# EAGLE schematic ADC3_FPGA_BGA (EAGLE 9.6.2)
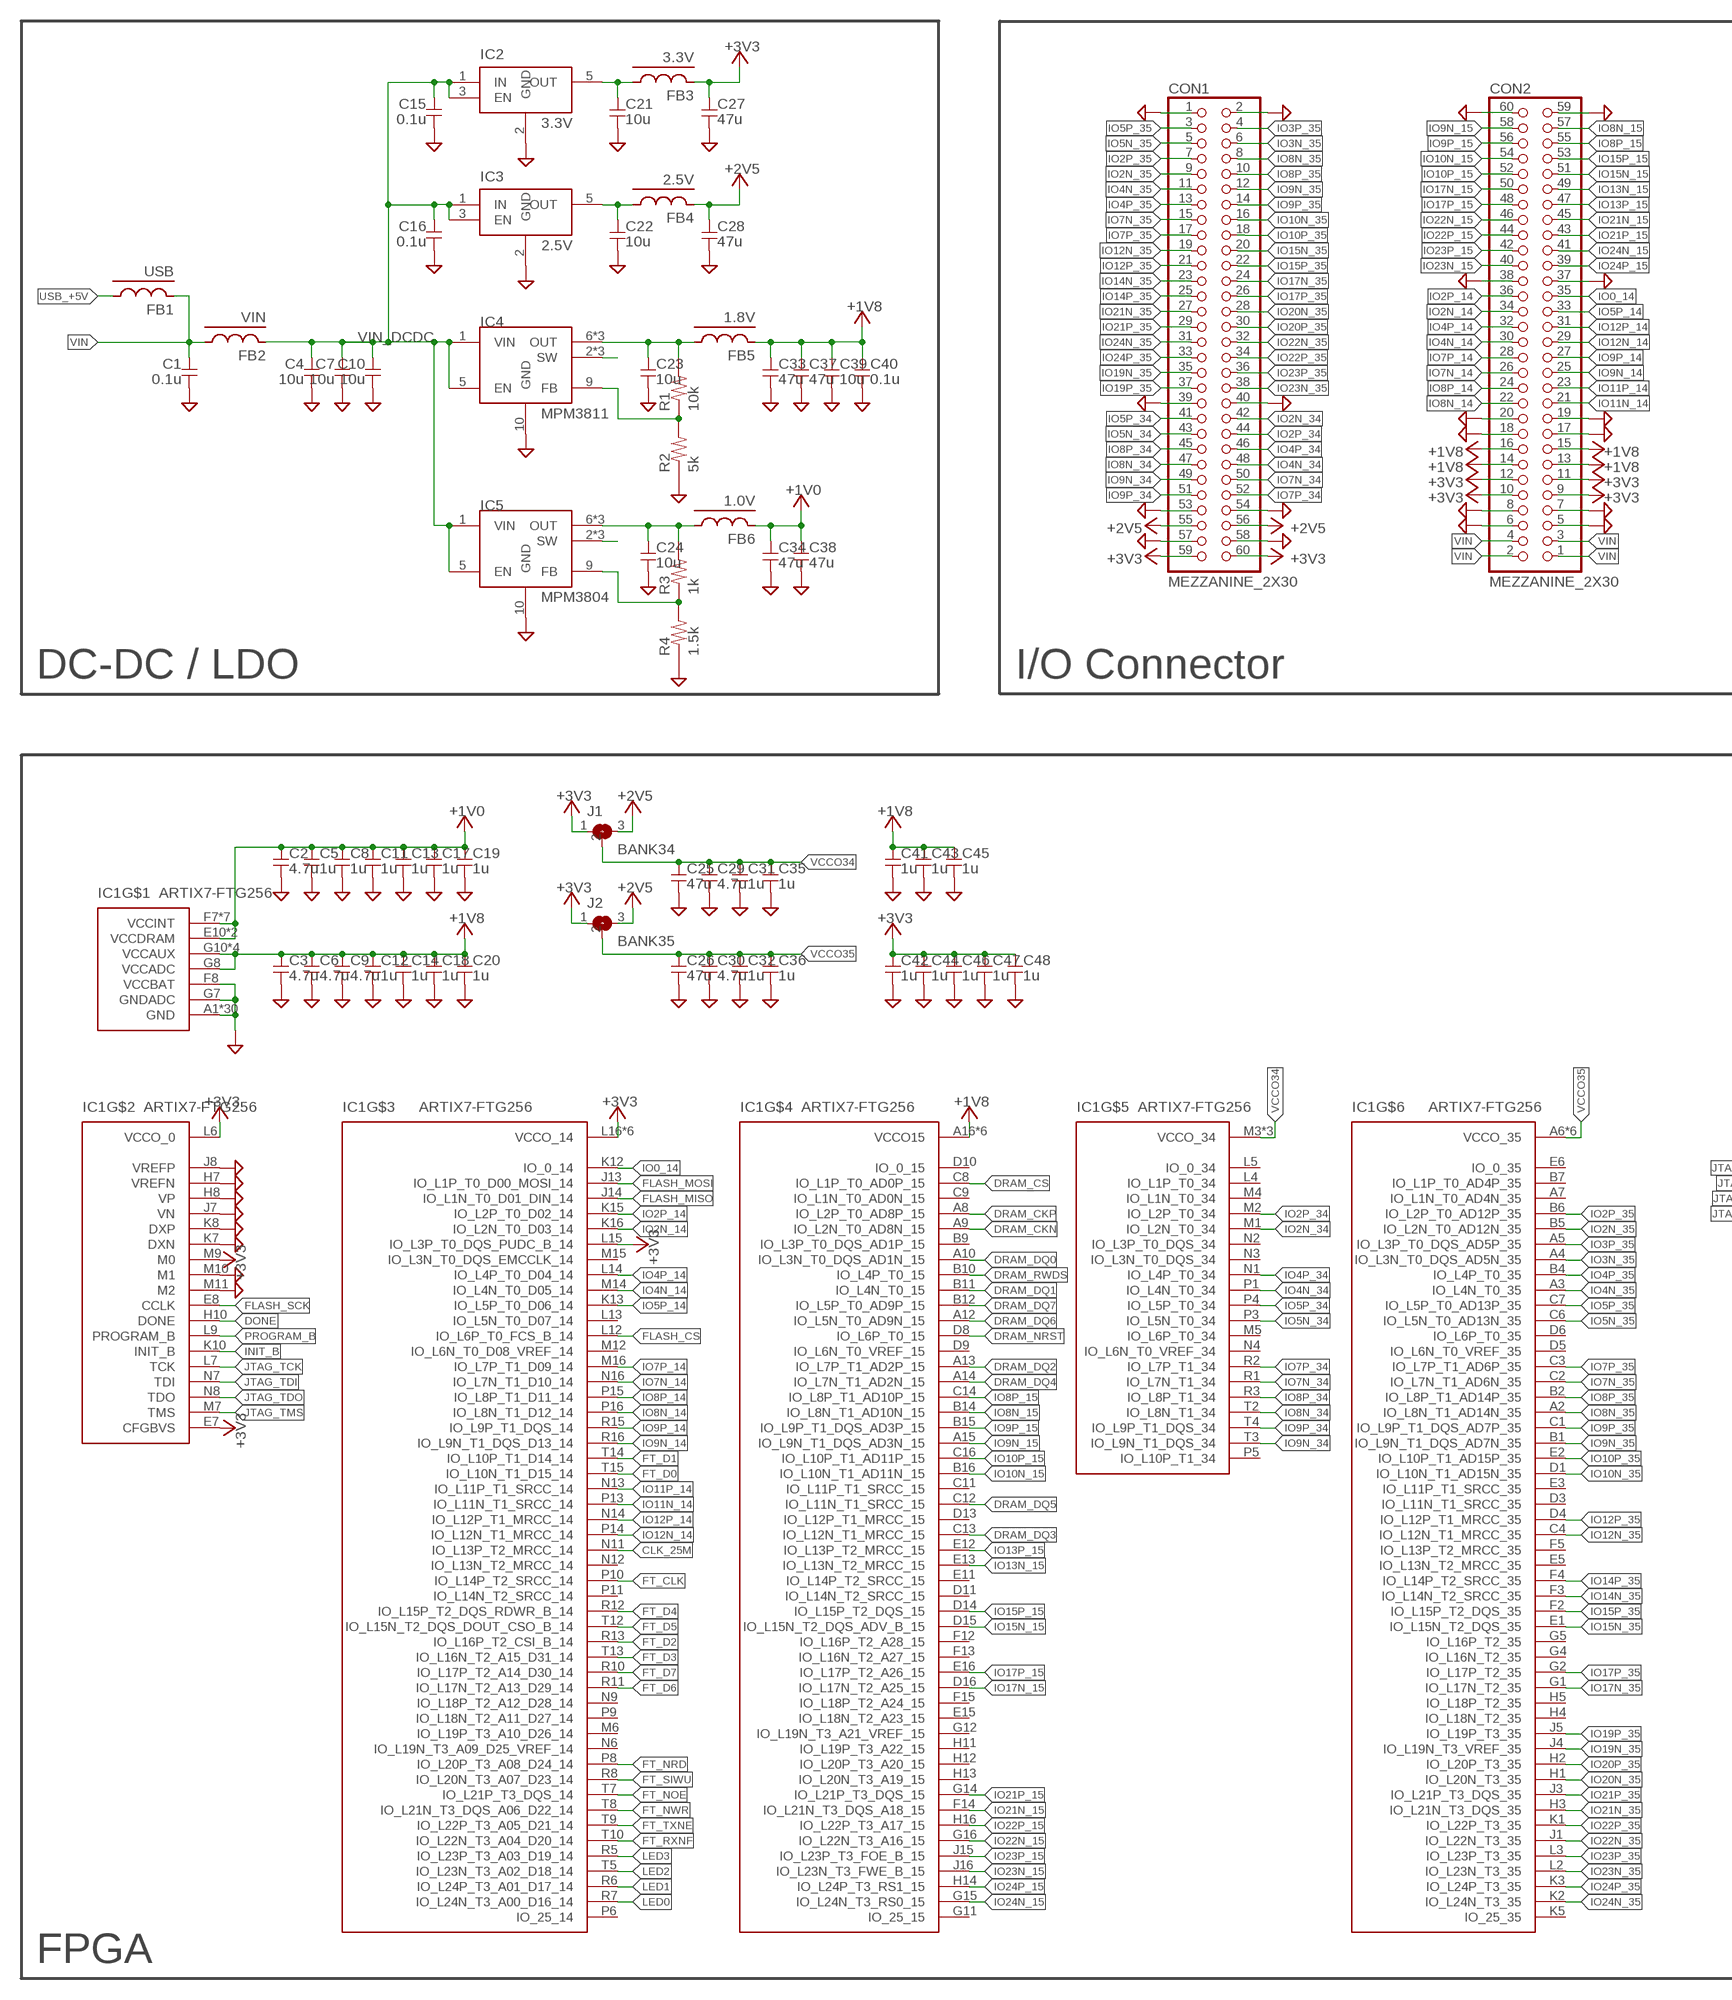
[diagram p0: schematic, sheet 1, part 1 of 2]
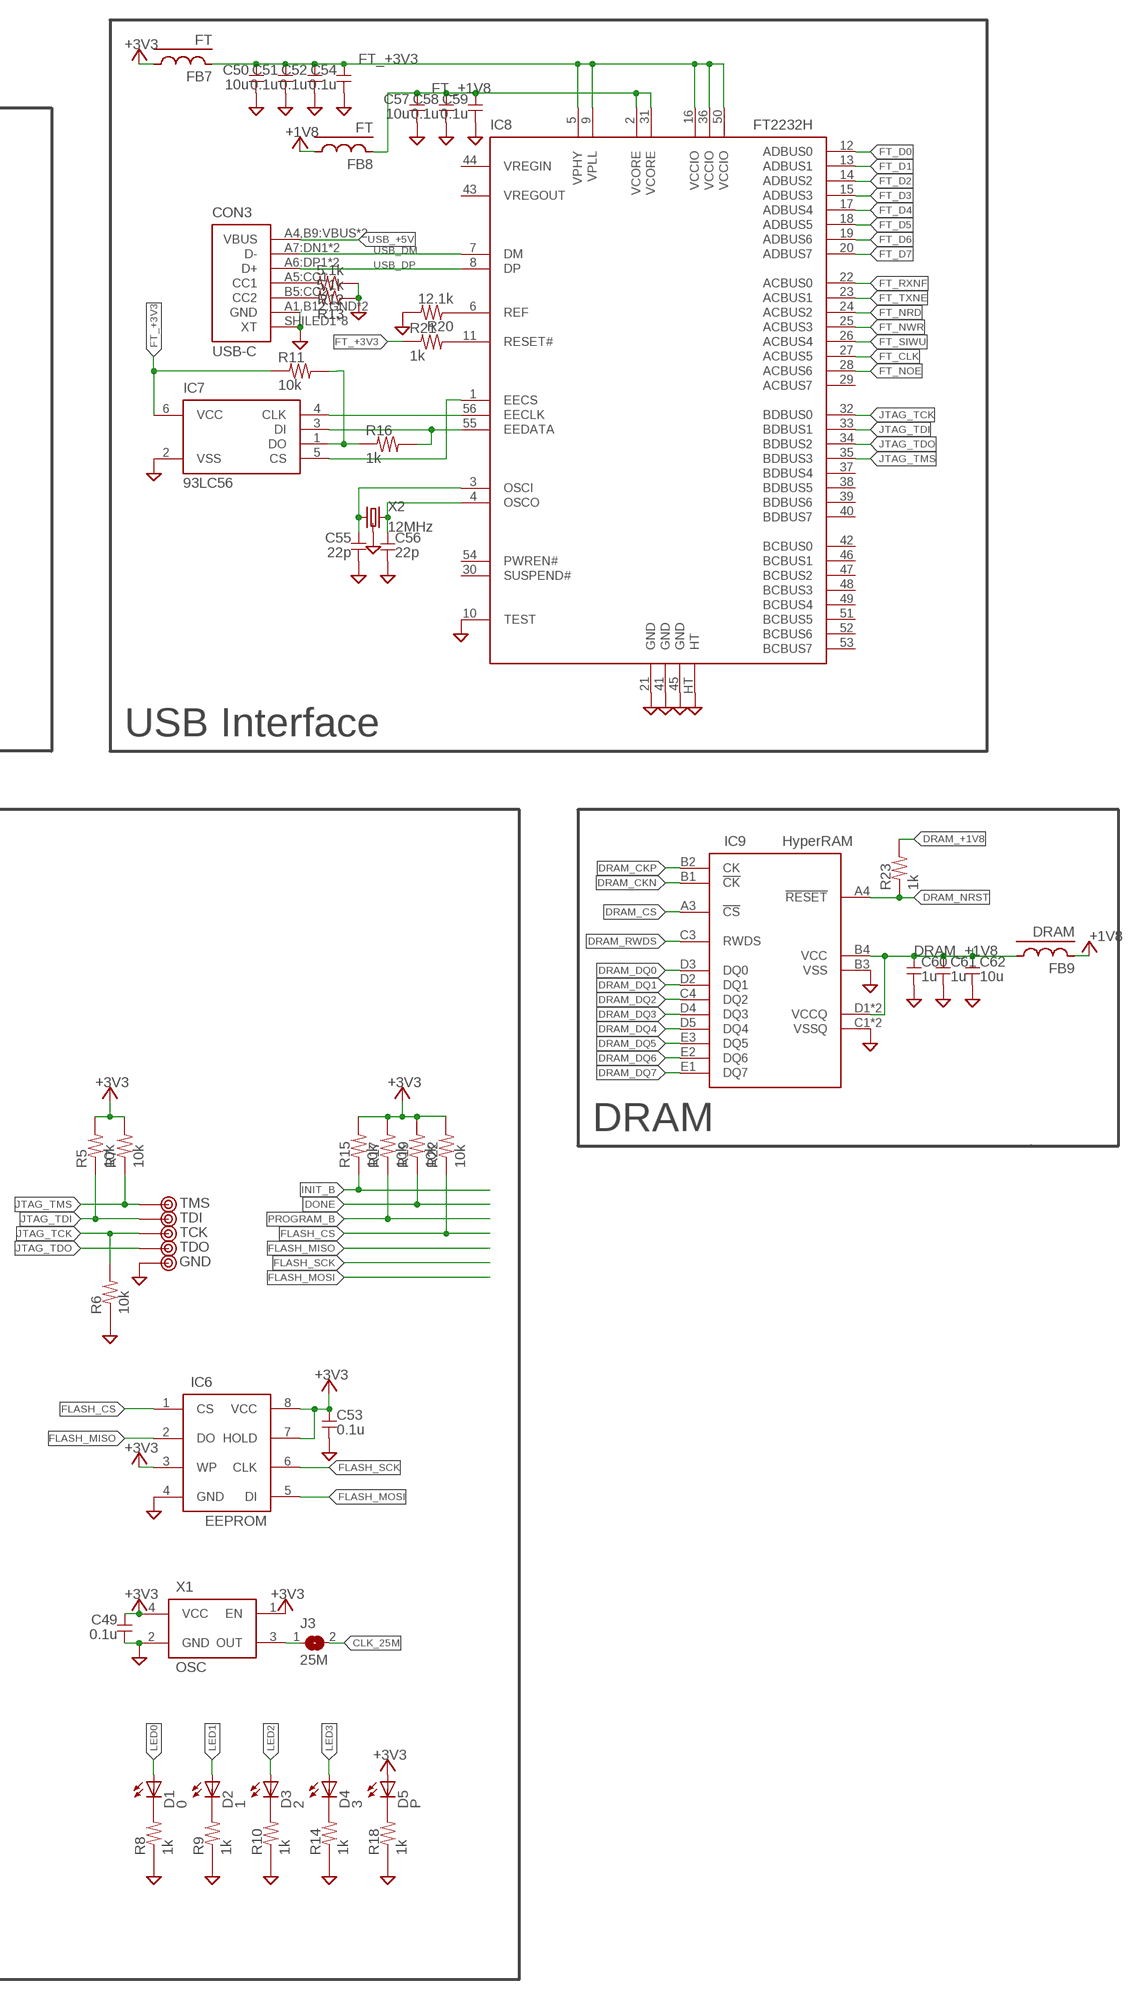
[diagram p1: schematic, sheet 1, part 2 of 2]

## Parts
C1  0.1u  C-1608  [1608C]
C2  4.7u  C-1608  [1608C]
C3  4.7u  C-1608  [1608C]
C4  10u  C-2012  [2012]
C5  1u  C-1005  [1005]
C6  4.7u  C-1608  [1608C]
C7  10u  C-1608  [1608C]
C8  1u  C-1005  [1005]
C9  4.7u  C-1608  [1608C]
C10  10u  C-1608  [1608C]
C11  1u  C-1005  [1005]
C12  1u  C-1005  [1005]
C13  1u  C-1005  [1005]
C14  1u  C-1005  [1005]
C15  0.1u  C-1608  [1608C]
C16  0.1u  C-1608  [1608C]
C17  1u  C-1005  [1005]
C18  1u  C-1005  [1005]
C19  1u  C-1005  [1005]
C20  1u  C-1005  [1005]
C21  10u  C-1608  [1608C]
C22  10u  C-1608  [1608C]
C23  10u  C-1608  [1608C]
C24  10u  C-1608  [1608C]
C25  47u  C-2012  [2012]
C26  47u  C-2012  [2012]
C27  47u  C-2012  [2012]
C28  47u  C-2012  [2012]
C29  4.7u  C-1608  [1608C]
C30  4.7u  C-1608  [1608C]
C31  1u  C-1005  [1005]
C32  1u  C-1005  [1005]
C33  47u  C-2012  [2012]
C34  47u  C-2012  [2012]
C35  1u  C-1005  [1005]
C36  1u  C-1005  [1005]
C37  47u  C-2012  [2012]
C38  47u  C-2012  [2012]
C39  10u  C-3216  [3216]
C40  0.1u  C-1608  [1608C]
C41  1u  C-1005  [1005]
C42  1u  C-1005  [1005]
C43  1u  C-1005  [1005]
C44  1u  C-1005  [1005]
C45  1u  C-1005  [1005]
C46  1u  C-1005  [1005]
C47  1u  C-1005  [1005]
C48  1u  C-1005  [1005]
C49  0.1u  C-1608  [1608C]
C50  10u  C-1608  [1608C]
C51  0.1u  C-1608  [1608C]
C52  0.1u  C-1608  [1608C]
C53  0.1u  C-1608  [1608C]
C54  0.1u  C-1608  [1608C]
C55  22p  C-1608  [1608C]
C56  22p  C-1608  [1608C]
C57  10u  C-1608  [1608C]
C58  0.1u  C-1608  [1608C]
C59  0.1u  C-1608  [1608C]
C60  1u  C-1608  [1608C]
C61  1u  C-1608  [1608C]
C62  10u  C-2012  [2012]
CON1  MEZZANINE_2X30  [MEZZANINE_0.8MM_2X30]
CON2  MEZZANINE_2X30  [MEZZANINE_0.8MM_2X30]
CON3  USB-C  [5077CR-16-SMC2-BK-TR]
D1  0  LED-SMD1608  [D1608]
D2  1  LED-SMD1608  [D1608]
D3  2  LED-SMD1608  [D1608]
D4  3  LED-SMD1608  [D1608]
D5  P  LED-SMD1608  [D1608]
FB1  USB  FB  [1608-J]
FB2  VIN  FB  [1608-J]
FB3  3.3V  FB  [1608-J]
FB4  2.5V  FB  [1608-J]
FB5  1.8V  FB  [1608-J]
FB6  1.0V  FB  [1608-J]
FB7  FT  FB  [1608-J]
FB8  FT  FB  [1608-J]
FB9  DRAM  FB  [1608-J]
IC1  ARTIX7-FTG256  [FTG256]
IC2  3.3V  TLV740  [SOT23-5]
IC3  2.5V  TLV740  [SOT23-5]
IC4  MPM3811  MPM3804  [QFN-10]
IC5  MPM3804  [QFN-10]
IC6  EEPROM  EEPROM_SPI-WIDE  [SOIC-SOIJ-8]
IC7  93LC56  [SOT23-6]
IC8  FT2232H  FT2232H-2  [QFN56-HT]
IC9  HyperRAM  HYPERRAM  [TFBGA24]
J1  BANK34  SJ-3-1608  [1608-3-J]
J2  BANK35  SJ-3-1608  [1608-3-J]
J3  25M  SJ-1608  [1608-J]
R1  10k  R-1608  [1608]
R2  5k  R-1608  [1608]
R3  1k  R-1608  [1608]
R4  1.5k  R-1608  [1608]
R5  10k  R-1608  [1608]
R6  10k  R-1608  [1608]
R7  10k  R-1608  [1608]
R8  1k  R-1608  [1608]
R9  1k  R-1608  [1608]
R10  1k  R-1608  [1608]
R11  10k  R-1608  [1608]
R12  5.1k  R-1608  [1608]
R13  5.1k  R-1608  [1608]
R14  1k  R-1608  [1608]
R15  10k  R-1608  [1608]
R16  1k  R-1608  [1608]
R17  10k  R-1608  [1608]
R18  1k  R-1608  [1608]
R19  10k  R-1608  [1608]
R20  12.1k  R-1608  [1608]
R21  1k  R-1608  [1608]
R22  10k  R-1608  [1608]
R23  1k  R-1608  [1608]
TP1  TMS  TESTPIN-PAD-SMALL  [TESTPAD-SMALL]
TP2  TDI  TESTPIN-PAD-SMALL  [TESTPAD-SMALL]
TP3  TCK  TESTPIN-PAD-SMALL  [TESTPAD-SMALL]
TP4  TDO  TESTPIN-PAD-SMALL  [TESTPAD-SMALL]
TP5  GND  TESTPIN-PAD-SMALL  [TESTPAD-SMALL]
X1  OSC  OSC-KC3225  [KC3225]
X2  12MHz  CRYSTAL2  [KC3225]

## Nets
1.0V_DCDC_SW: IC5.2(SW) IC5.3(SW) IC5.4(SW)
1.8V_DCDC_SW: IC4.2(SW) IC4.3(SW) IC4.4(SW)
+1V0: C2.1 C5.1 C8.1 C11.1 C13.1 C17.1 C19.1 C34.1 C38.1 FB6.2 IC1.E10(VCCDRAM) IC1.F7(VCCINT) IC1.F9(VCCINT) IC1.F11(VCCDRAM) IC1.G6(VCCINT) IC1.H9(VCCINT) IC1.J6(VCCINT) IC1.K9(VCCINT) IC1.L8(VCCINT)
+1V0_DCDC: C24.1 FB6.1 IC5.6(OUT) IC5.7(OUT) IC5.8(OUT) R3.2
+1V0_DCDC_FB: IC5.9(FB) R3.1 R4.2
+1V8: C3.1 C6.1 C9.1 C12.1 C14.1 C18.1 C20.1 C33.1 C37.1 C39.1 C40.1 C41.1 C43.1 C45.1 CON2.13 CON2.14 CON2.15 CON2.16 FB5.2 FB8.1 FB9.2 IC1.A16(VCCO15) IC1.B13(VCCO15) IC1.C10(VCCO15) IC1.E14(VCCO15) IC1.G8(VCCADC) IC1.G10(VCCAUX) IC1.H15(VCCO15) IC1.J10(VCCAUX) IC1.J12(VCCO15) IC1.K11(VCCAUX) IC1.L10(VCCAUX)
+1V8_DCDC: C23.1 FB5.1 IC4.6(OUT) IC4.7(OUT) IC4.8(OUT) R1.2
+1V8_DCDC_FB: IC4.9(FB) R1.1 R2.2
+2V5: C28.1 CON1.55 CON1.56 FB4.2 J1.3 J2.3
+2V5_LDO: C22.1 FB4.1 IC3.5(OUT)
+3V3: C27.1 C42.1 C44.1 C46.1 C47.1 C48.1 C49.1 C53.1 CON1.59 CON1.60 CON2.9 CON2.10 CON2.11 CON2.12 D5.A FB3.2 FB7.1 IC1.E7(CFGBVS) IC1.L6(VCCO_0) IC1.L15(IO_L3P_T0_DQS_PUDC_B_14) IC1.L16(VCCO_14) IC1.M9(M0) IC1.M13(VCCO_14) IC1.N10(VCCO_14) IC1.P7(VCCO_14) IC1.R14(VCCO_14) IC1.T11(VCCO_14) IC6.3(WP) IC6.7(HOLD) IC6.8(VCC) J1.1 J2.1 R5.2 R7.2 R15.2 R17.2 R19.2 R22.2 X1.1(EN) X1.4(VCC)
+3V3_LDO: C21.1 FB3.1 IC2.5(OUT)
CLK_25M: IC1.N11(IO_L13P_T2_MRCC_14) J3.2
DONE: IC1.H10(DONE) R19.1
DRAM_+1V8: C60.1 C61.1 C62.1 FB9.1 IC9.B4(VCC) IC9.D1(VCCQ) IC9.E4(VCCQ) R23.2
DRAM_CKN: IC1.A9(IO_L2N_T0_AD8N_15) IC9.B1(!CK)
DRAM_CKP: IC1.A8(IO_L2P_T0_AD8P_15) IC9.B2(CK)
DRAM_CS: IC1.C8(IO_L1P_T0_AD0P_15) IC9.A3(!CS)
DRAM_DQ0: IC1.A10(IO_L3N_T0_DQS_AD1N_15) IC9.D3(DQ0)
DRAM_DQ1: IC1.B11(IO_L4N_T0_15) IC9.D2(DQ1)
DRAM_DQ2: IC1.A13(IO_L7P_T1_AD2P_15) IC9.C4(DQ2)
DRAM_DQ3: IC1.C13(IO_L12N_T1_MRCC_15) IC9.D4(DQ3)
DRAM_DQ4: IC1.A14(IO_L7N_T1_AD2N_15) IC9.D5(DQ4)
DRAM_DQ5: IC1.C12(IO_L11N_T1_SRCC_15) IC9.E3(DQ5)
DRAM_DQ6: IC1.A12(IO_L5N_T0_AD9N_15) IC9.E2(DQ6)
DRAM_DQ7: IC1.B12(IO_L5P_T0_AD9P_15) IC9.E1(DQ7)
DRAM_NRST: IC1.D8(IO_L6P_T0_15) IC9.A4(!RESET) R23.1
DRAM_RWDS: IC1.B10(IO_L4P_T0_15) IC9.C3(RWDS)
FLASH_CS: IC1.L12(IO_L6P_T0_FCS_B_14) IC6.1(CS) R22.1
FLASH_MISO: IC1.J14(IO_L1N_T0_D01_DIN_14) IC6.2(DO)
FLASH_MOSI: IC1.J13(IO_L1P_T0_D00_MOSI_14) IC6.5(DI)
FLASH_SCK: IC1.E8(CCLK) IC6.6(CLK)
FT_+1V8: C57.1 C58.1 C59.1 FB8.2 IC8.2(VCORE) IC8.31(VCORE)
FT_+3V3: C50.1 C51.1 C52.1 C54.1 FB7.2 IC7.6(VCC) IC8.5(VPHY) IC8.9(VPLL) IC8.16(VCCIO) IC8.36(VCCIO) IC8.50(VCCIO) R11.1 R21.1
FT_CLK: IC1.P10(IO_L14P_T2_SRCC_14) IC8.27(ACBUS5)
FT_D0: IC1.T15(IO_L10N_T1_D15_14) IC8.12(ADBUS0)
FT_D1: IC1.T14(IO_L10P_T1_D14_14) IC8.13(ADBUS1)
FT_D2: IC1.R13(IO_L16P_T2_CSI_B_14) IC8.14(ADBUS2)
FT_D3: IC1.T13(IO_L16N_T2_A15_D31_14) IC8.15(ADBUS3)
FT_D4: IC1.R12(IO_L15P_T2_DQS_RDWR_B_14) IC8.17(ADBUS4)
FT_D5: IC1.T12(IO_L15N_T2_DQS_DOUT_CSO_B_14) IC8.18(ADBUS5)
FT_D6: IC1.R11(IO_L17N_T2_A13_D29_14) IC8.19(ADBUS6)
FT_D7: IC1.R10(IO_L17P_T2_A14_D30_14) IC8.20(ADBUS7)
FT_NOE: IC1.T7(IO_L21P_T3_DQS_14) IC8.28(ACBUS6)
FT_NRD: IC1.P8(IO_L20P_T3_A08_D24_14) IC8.24(ACBUS2)
FT_NWR: IC1.T8(IO_L21N_T3_DQS_A06_D22_14) IC8.25(ACBUS3)
FT_RXNF: IC1.T10(IO_L22N_T3_A04_D20_14) IC8.22(ACBUS0)
FT_SIWU: IC1.R8(IO_L20N_T3_A07_D23_14) IC8.26(ACBUS4)
FT_TXNE: IC1.T9(IO_L22P_T3_A05_D21_14) IC8.23(ACBUS1)
GND: C1.2 C2.2 C3.2 C4.2 C5.2 C6.2 C7.2 C8.2 C9.2 C10.2 C11.2 C12.2 C13.2 C14.2 C15.2 C16.2 C17.2 C18.2 C19.2 C20.2 C21.2 C22.2 C23.2 C24.2 C25.2 C26.2 C27.2 C28.2 C29.2 C30.2 C31.2 C32.2 C33.2 C34.2 C35.2 C36.2 C37.2 C38.2 C39.2 C40.2 C41.2 C42.2 C43.2 C44.2 C45.2 C46.2 C47.2 C48.2 C49.2 C50.2 C51.2 C52.2 C53.2 C54.2 C55.2 C56.2 C57.2 C58.2 C59.2 C60.2 C61.2 C62.2 CON1.1 CON1.2 CON1.39 CON1.40 CON1.53 CON1.54 CON1.57 CON1.58 CON2.5 CON2.6 CON2.7 CON2.8 CON2.17 CON2.18 CON2.19 CON2.20 CON2.37 CON2.38 CON2.59 CON2.60 CON3.A1,B12:GND(GND) CON3.B1,A12:GND(GND) CON3.SHILED1(XT) CON3.SHILED2(XT) CON3.SHILED3(XT) CON3.SHILED4(XT) CON3.SHILED5(XT) CON3.SHILED6(XT) CON3.SHILED7(XT) CON3.SHILED8(XT) IC1.A1(GND) IC1.A11(GND) IC1.B8(GND) IC1.C5(GND) IC1.C15(GND) IC1.D2(GND) IC1.D12(GND) IC1.E9(GND) IC1.F6(GND) IC1.F8(VCCBAT) IC1.F10(GND) IC1.F16(GND) IC1.G3(GND) IC1.G7(GNDADC) IC1.G9(GND) IC1.G13(GND) IC1.H6(GND) IC1.H7(VREFN) IC1.H8(VP) IC1.J7(VN) IC1.J8(VREFP) IC1.J9(GND) IC1.J11(GND) IC1.K4(GND) IC1.K6(GND) IC1.K7(DXN) IC1.K8(DXP) IC1.K14(GND) IC1.L1(GND) IC1.L11(GND) IC1.M8(GND) IC1.M10(M1) IC1.M11(M2) IC1.N5(GND) IC1.N15(GND) IC1.P2(GND) IC1.P12(GND) IC1.R9(GND) IC1.T6(GND) IC1.T16(GND) IC2.2(GND) IC3.2(GND) IC4.10(GND) IC5.10(GND) IC6.4(GND) IC7.2(VSS) IC8.10(TEST) IC8.21(GND) IC8.41(GND) IC8.45(GND) IC8.HT IC9.B3(VSS) IC9.C1(VSSQ) IC9.E5(VSSQ) R2.1 R4.1 R6.1 R8.1 R9.1 R10.1 R12.1 R13.1 R14.1 R18.1 R20.2 TP5.1 X1.2(GND) X2.2(GND) X2.4(GND)
INIT_B: IC1.K10(INIT_B) R15.1
IO0_14: CON2.35 IC1.K12(IO_0_14)
IO2N_14: CON2.34 IC1.K16(IO_L2N_T0_D03_14)
IO2N_34: CON1.42 IC1.M1(IO_L2N_T0_34)
IO2N_35: CON1.9 IC1.B5(IO_L2N_T0_AD12N_35)
IO2P_14: CON2.36 IC1.K15(IO_L2P_T0_D02_14)
IO2P_34: CON1.44 IC1.M2(IO_L2P_T0_34)
IO2P_35: CON1.7 IC1.B6(IO_L2P_T0_AD12P_35)
IO3N_35: CON1.6 IC1.A4(IO_L3N_T0_DQS_AD5N_35)
IO3P_35: CON1.4 IC1.A5(IO_L3P_T0_DQS_AD5P_35)
IO4N_14: CON2.30 IC1.M14(IO_L4N_T0_D05_14)
IO4N_34: CON1.48 IC1.P1(IO_L4N_T0_34)
IO4N_35: CON1.11 IC1.A3(IO_L4N_T0_35)
IO4P_14: CON2.32 IC1.L14(IO_L4P_T0_D04_14)
IO4P_34: CON1.46 IC1.N1(IO_L4P_T0_34)
IO4P_35: CON1.13 IC1.B4(IO_L4P_T0_35)
IO5N_34: CON1.43 IC1.P3(IO_L5N_T0_34)
IO5N_35: CON1.5 IC1.C6(IO_L5N_T0_AD13N_35)
IO5P_14: CON2.33 IC1.K13(IO_L5P_T0_D06_14)
IO5P_34: CON1.41 IC1.P4(IO_L5P_T0_34)
IO5P_35: CON1.3 IC1.C7(IO_L5P_T0_AD13P_35)
IO7N_14: CON2.26 IC1.N16(IO_L7N_T1_D10_14)
IO7N_34: CON1.50 IC1.R1(IO_L7N_T1_34)
IO7N_35: CON1.15 IC1.C2(IO_L7N_T1_AD6N_35)
IO7P_14: CON2.28 IC1.M16(IO_L7P_T1_D09_14)
IO7P_34: CON1.52 IC1.R2(IO_L7P_T1_34)
IO7P_35: CON1.17 IC1.C3(IO_L7P_T1_AD6P_35)
IO8N_14: CON2.22 IC1.P16(IO_L8N_T1_D12_14)
IO8N_15: CON2.57 IC1.B14(IO_L8N_T1_AD10N_15)
IO8N_34: CON1.47 IC1.T2(IO_L8N_T1_34)
IO8N_35: CON1.8 IC1.A2(IO_L8N_T1_AD14N_35)
IO8P_14: CON2.24 IC1.P15(IO_L8P_T1_D11_14)
IO8P_15: CON2.55 IC1.C14(IO_L8P_T1_AD10P_15)
IO8P_34: CON1.45 IC1.R3(IO_L8P_T1_34)
IO8P_35: CON1.10 IC1.B2(IO_L8P_T1_AD14P_35)
IO9N_14: CON2.25 IC1.R16(IO_L9N_T1_DQS_D13_14)
IO9N_15: CON2.58 IC1.A15(IO_L9N_T1_DQS_AD3N_15)
IO9N_34: CON1.49 IC1.T3(IO_L9N_T1_DQS_34)
IO9N_35: CON1.12 IC1.B1(IO_L9N_T1_DQS_AD7N_35)
IO9P_14: CON2.27 IC1.R15(IO_L9P_T1_DQS_14)
IO9P_15: CON2.56 IC1.B15(IO_L9P_T1_DQS_AD3P_15)
IO9P_34: CON1.51 IC1.T4(IO_L9P_T1_DQS_34)
IO9P_35: CON1.14 IC1.C1(IO_L9P_T1_DQS_AD7P_35)
IO10N_15: CON2.54 IC1.B16(IO_L10N_T1_AD11N_15)
IO10N_35: CON1.16 IC1.D1(IO_L10N_T1_AD15N_35)
IO10P_15: CON2.52 IC1.C16(IO_L10P_T1_AD11P_15)
IO10P_35: CON1.18 IC1.E2(IO_L10P_T1_AD15P_35)
IO11N_14: CON2.21 IC1.P13(IO_L11N_T1_SRCC_14)
IO11P_14: CON2.23 IC1.N13(IO_L11P_T1_SRCC_14)
IO12N_14: CON2.29 IC1.P14(IO_L12N_T1_MRCC_14)
IO12N_35: CON1.19 IC1.C4(IO_L12N_T1_MRCC_35)
IO12P_14: CON2.31 IC1.N14(IO_L12P_T1_MRCC_14)
IO12P_35: CON1.21 IC1.D4(IO_L12P_T1_MRCC_35)
IO13N_15: CON2.49 IC1.E13(IO_L13N_T2_MRCC_15)
IO13P_15: CON2.47 IC1.E12(IO_L13P_T2_MRCC_15)
IO14N_35: CON1.23 IC1.F3(IO_L14N_T2_SRCC_35)
IO14P_35: CON1.25 IC1.F4(IO_L14P_T2_SRCC_35)
IO15N_15: CON2.51 IC1.D15(IO_L15N_T2_DQS_ADV_B_15)
IO15N_35: CON1.20 IC1.E1(IO_L15N_T2_DQS_35)
IO15P_15: CON2.53 IC1.D14(IO_L15P_T2_DQS_15)
IO15P_35: CON1.22 IC1.F2(IO_L15P_T2_DQS_35)
IO17N_15: CON2.50 IC1.D16(IO_L17N_T2_A25_15)
IO17N_35: CON1.24 IC1.G1(IO_L17N_T2_35)
IO17P_15: CON2.48 IC1.E16(IO_L17P_T2_A26_15)
IO17P_35: CON1.26 IC1.G2(IO_L17P_T2_35)
IO19N_35: CON1.35 IC1.J4(IO_L19N_T3_VREF_35)
IO19P_35: CON1.37 IC1.J5(IO_L19P_T3_35)
IO20N_35: CON1.28 IC1.H1(IO_L20N_T3_35)
IO20P_35: CON1.30 IC1.H2(IO_L20P_T3_35)
IO21N_15: CON2.45 IC1.F14(IO_L21N_T3_DQS_A18_15)
IO21N_35: CON1.27 IC1.H3(IO_L21N_T3_DQS_35)
IO21P_15: CON2.43 IC1.G14(IO_L21P_T3_DQS_15)
IO21P_35: CON1.29 IC1.J3(IO_L21P_T3_DQS_35)
IO22N_15: CON2.46 IC1.G16(IO_L22N_T3_A16_15)
IO22N_35: CON1.32 IC1.J1(IO_L22N_T3_35)
IO22P_15: CON2.44 IC1.H16(IO_L22P_T3_A17_15)
IO22P_35: CON1.34 IC1.K1(IO_L22P_T3_35)
IO23N_15: CON2.40 IC1.J16(IO_L23N_T3_FWE_B_15)
IO23N_35: CON1.38 IC1.L2(IO_L23N_T3_35)
IO23P_15: CON2.42 IC1.J15(IO_L23P_T3_FOE_B_15)
IO23P_35: CON1.36 IC1.L3(IO_L23P_T3_35)
IO24N_15: CON2.41 IC1.G15(IO_L24N_T3_RS0_15)
IO24N_35: CON1.31 IC1.K2(IO_L24N_T3_35)
IO24P_15: CON2.39 IC1.H14(IO_L24P_T3_RS1_15)
IO24P_35: CON1.33 IC1.K3(IO_L24P_T3_35)
JTAG_TCK: IC1.L7(TCK) IC8.32(BDBUS0) R6.2 TP3.1
JTAG_TDI: IC1.N7(TDI) IC8.33(BDBUS1) R5.1 TP2.1
JTAG_TDO: IC1.N8(TDO) IC8.34(BDBUS2) TP4.1
JTAG_TMS: IC1.M7(TMS) IC8.35(BDBUS3) R7.1 TP1.1
LED0: D1.A IC1.R7(IO_L24N_T3_A00_D16_14)
LED1: D2.A IC1.R6(IO_L24P_T3_A01_D17_14)
LED2: D3.A IC1.T5(IO_L23N_T3_A02_D18_14)
LED3: D4.A IC1.R5(IO_L23P_T3_A03_D19_14)
N$1: D5.K R18.2
N$2: D1.K R8.2
N$3: D2.K R9.2
N$4: D3.K R10.2
N$5: D4.K R14.2
N$6: CON3.A5:CC1(CC1) R12.2
N$7: CON3.B5:CC2(CC2) R13.2
N$8: J3.1 X1.3(OUT)
N$9: IC7.4(CLK) IC8.56(EECLK)
N$10: IC7.3(DI) IC8.55(EEDATA) R16.2
N$11: IC7.5(CS) IC8.1(EECS)
N$12: IC7.1(DO) R11.2 R16.1
N$13: C56.1 IC8.4(OSCO) X2.3
N$14: C55.1 IC8.3(OSCI) X2.1
N$15: IC8.6(REF) R20.1
N$16: IC8.11(RESET#) R21.2
PROGRAM_B: IC1.L9(PROGRAM_B) R17.1
USB_+5V: CON3.A4,B9:VBUS(VBUS) CON3.B4,A9:VBUS(VBUS) FB1.1
USB_DM: CON3.A7:DN1(D-) CON3.B7:DN2(D-) IC8.7(DM)
USB_DP: CON3.A6:DP1(D+) CON3.B6:DP2(D+) IC8.8(DP)
VCCO34: C25.1 C29.1 C31.1 C35.1 IC1.M3(VCCO_34) IC1.R4(VCCO_34) IC1.T1(VCCO_34) J1.2
VCCO35: C26.1 C30.1 C32.1 C36.1 IC1.A6(VCCO_35) IC1.B3(VCCO_35) IC1.D7(VCCO_35) IC1.E4(VCCO_35) IC1.F1(VCCO_35) IC1.J2(VCCO_35) J2.2
VIN: C1.1 CON2.1 CON2.2 CON2.3 CON2.4 FB1.2 FB2.1
VIN_DCDC: C4.1 C7.1 C10.1 C15.1 C16.1 FB2.2 IC2.1(IN) IC2.3(EN) IC3.1(IN) IC3.3(EN) IC4.1(VIN) IC4.5(EN) IC5.1(VIN) IC5.5(EN)
Unconnected: IC1.A7(IO_L1N_T0_AD4N_35) IC1.B7(IO_L1P_T0_AD4P_35) IC1.B9(IO_L3P_T0_DQS_AD1P_15) IC1.C9(IO_L1N_T0_AD0N_15) IC1.C11(IO_L11P_T1_SRCC_15) IC1.D3(IO_L11N_T1_SRCC_35) IC1.D5(IO_L6N_T0_VREF_35) IC1.D6(IO_L6P_T0_35) IC1.D9(IO_L6N_T0_VREF_15) IC1.D10(IO_0_15) IC1.D11(IO_L14N_T2_SRCC_15) IC1.D13(IO_L12P_T1_MRCC_15) IC1.E3(IO_L11P_T1_SRCC_35) IC1.E5(IO_L13N_T2_MRCC_35) IC1.E6(IO_0_35) IC1.E11(IO_L14P_T2_SRCC_15) IC1.E15(IO_L18N_T2_A23_15) IC1.F5(IO_L13P_T2_MRCC_35) IC1.F12(IO_L16P_T2_A28_15) IC1.F13(IO_L16N_T2_A27_15) IC1.F15(IO_L18P_T2_A24_15) IC1.G4(IO_L16N_T2_35) IC1.G5(IO_L16P_T2_35) IC1.G11(IO_25_15) IC1.G12(IO_L19N_T3_A21_VREF_15) IC1.H4(IO_L18N_T2_35) IC1.H5(IO_L18P_T2_35) IC1.H11(IO_L19P_T3_A22_15) IC1.H12(IO_L20P_T3_A20_15) IC1.H13(IO_L20N_T3_A19_15) IC1.K5(IO_25_35) IC1.L4(IO_L1P_T0_34) IC1.L5(IO_0_34) IC1.L13(IO_L5N_T0_D07_14) IC1.M4(IO_L1N_T0_34) IC1.M5(IO_L6P_T0_34) IC1.M6(IO_L19P_T3_A10_D26_14) IC1.M12(IO_L6N_T0_D08_VREF_14) IC1.M15(IO_L3N_T0_DQS_EMCCLK_14) IC1.N2(IO_L3P_T0_DQS_34) IC1.N3(IO_L3N_T0_DQS_34) IC1.N4(IO_L6N_T0_VREF_34) IC1.N6(IO_L19N_T3_A09_D25_VREF_14) IC1.N9(IO_L18P_T2_A12_D28_14) IC1.N12(IO_L13N_T2_MRCC_14) IC1.P5(IO_L10P_T1_34) IC1.P6(IO_25_14) IC1.P9(IO_L18N_T2_A11_D27_14) IC1.P11(IO_L14N_T2_SRCC_14) IC8.29(ACBUS7) IC8.30(SUSPEND#) IC8.37(BDBUS4) IC8.38(BDBUS5) IC8.39(BDBUS6) IC8.40(BDBUS7) IC8.42(BCBUS0) IC8.43(VREGOUT) IC8.44(VREGIN) IC8.46(BCBUS1) IC8.47(BCBUS2) IC8.48(BCBUS3) IC8.49(BCBUS4) IC8.51(BCBUS5) IC8.52(BCBUS6) IC8.53(BCBUS7) IC8.54(PWREN#)

## Notes on the sheet
- DC-DC / LDO | I/O Connector | USB Interface
- DRAM
- FPGA

## Library data of the parts
C1-C62 = my_rcl:C
CON1 CON2 = my_connector:MEZZANINE_2X30
CON3 = my_connector:USB-C
D1-D5 = my_rcl:LED
FB1-FB9 = my_rcl:FB
IC1 = my_ic:ARTIX7-FTG256
IC2 IC3 = my_ic:TLV740
IC4 IC5 = my_ic:MPM3804
IC6 = my_ic:EEPROM_SPI
IC7 = my_ic:93LC56
IC8 = my_ic:FT2232H
IC9 = my_ic:HYPERRAM
J1 J2 = my_rcl:SJ-3
J3 = my_rcl:SJ
R1-R23 = my_rcl:R
TP1-TP5 = my_connector:TESTPIN
X1 = my_rcl:OSC
X2 = my_rcl:CRYSTAL2: CRYSTAL